# EAGLE schematic AOA-control-revC (EAGLE 7.0.0)
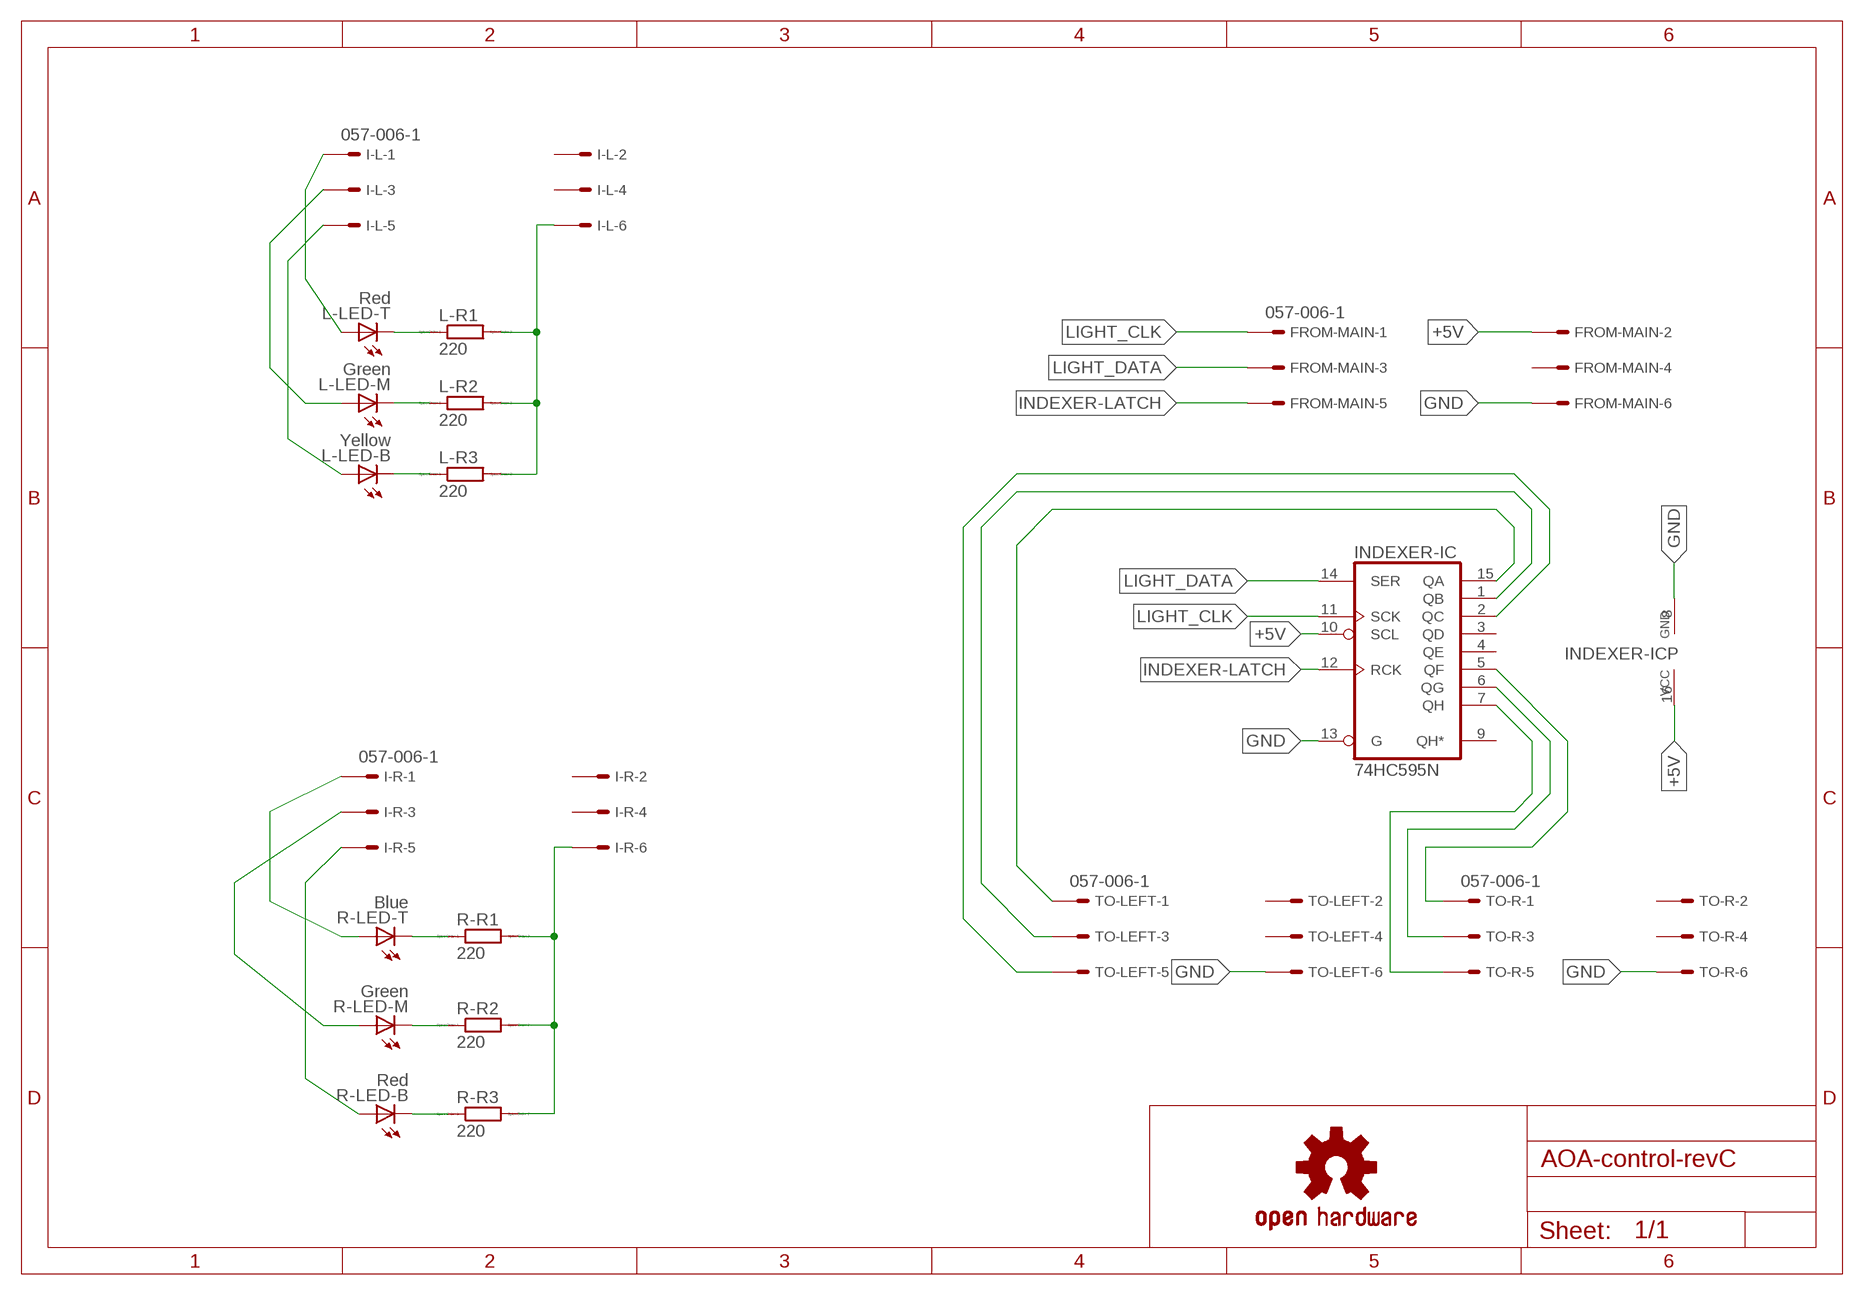
[diagram p0: schematic, sheet 1]

## Parts
FROM-MAIN  057-006-1  [057-006-1]
I-L  057-006-1  [057-006-1]
I-R  057-006-1  [057-006-1]
INDEXER-IC  74HC595N  [DIL16]
L-LED-B  Yellow  LED-2AC-CP41B-WGS  [CP41B]
L-LED-M  Green  LED-2AC-CP41B-WGS  [CP41B]
L-LED-T  Red  LED-2AC-CP41B-WGS  [CP41B]
L-R1  220  R0204/7  [0204/7]
L-R2  220  R0204/7  [0204/7]
L-R3  220  R0204/7  [0204/7]
LOGO1  OSHW-LOGOS  [OSHW-LOGO-S]
R-LED-B  Red  LED-2AC-CP41B-WGS  [CP41B]
R-LED-M  Green  LED-2AC-CP41B-WGS  [CP41B]
R-LED-T  Blue  LED-2AC-CP41B-WGS  [CP41B]
R-R1  220  R0204/7  [0204/7]
R-R2  220  R0204/7  [0204/7]
R-R3  220  R0204/7  [0204/7]
TO-LEFT  057-006-1  [057-006-1]
TO-R  057-006-1  [057-006-1]

## Nets
+5V [Power]: FROM-MAIN.2 INDEXER-IC.10(SCL) INDEXER-IC.16(VCC)
GND [Power]: FROM-MAIN.6 I-L.6 I-R.6 INDEXER-IC.8(GND) INDEXER-IC.13(G) L-R1.2 L-R2.2 L-R3.2 R-R1.2 R-R2.2 R-R3.2 TO-LEFT.6 TO-R.6
INDEXER-LATCH [Signal]: FROM-MAIN.5 INDEXER-IC.12(RCK)
L-B: INDEXER-IC.2(QC) TO-LEFT.5
L-M: INDEXER-IC.1(QB) TO-LEFT.3
L-T: INDEXER-IC.15(QA) TO-LEFT.1
LIGHT_CLK [Signal]: FROM-MAIN.1 INDEXER-IC.11(SCK)
LIGHT_DATA [Signal]: FROM-MAIN.3 INDEXER-IC.14(SER)
N$1 [Signal]: I-L.1 L-LED-T.2(A) L-LED-T.3(A)
N$2 [Signal]: I-L.3 L-LED-M.2(A) L-LED-M.3(A)
N$3 [Signal]: I-L.5 L-LED-B.2(A) L-LED-B.3(A)
N$4 [Signal]: R-LED-B.1(C) R-LED-B.4(C) R-R3.1
N$5 [Signal]: I-R.1 R-LED-T.2(A) R-LED-T.3(A)
N$6 [Signal]: I-R.3 R-LED-M.2(A) R-LED-M.3(A)
N$7 [Signal]: I-R.5 R-LED-B.2(A) R-LED-B.3(A)
N$8 [Signal]: L-LED-B.1(C) L-LED-B.4(C) L-R3.1
N$9 [Signal]: L-LED-M.1(C) L-LED-M.4(C) L-R2.1
N$10 [Signal]: L-LED-T.1(C) L-LED-T.4(C) L-R1.1
N$12 [Signal]: R-LED-M.1(C) R-LED-M.4(C) R-R2.1
N$13 [Signal]: R-LED-T.1(C) R-LED-T.4(C) R-R1.1
R-B: INDEXER-IC.7(QH) TO-R.5
R-M: INDEXER-IC.6(QG) TO-R.3
R-T: INDEXER-IC.5(QF) TO-R.1
Unconnected: FROM-MAIN.4 I-L.2 I-L.4 I-R.2 I-R.4 INDEXER-IC.3(QD) INDEXER-IC.4(QE) INDEXER-IC.9(QH*) TO-LEFT.2 TO-LEFT.4 TO-R.2 TO-R.4

## Library data of the parts
FROM-MAIN I-L I-R TO-LEFT TO-R = con-panduit:057-006-: CONNECTOR 6-pin series 057 contact pc board low profile headers; OC_FARNELL: unknown; OC_NEWARK: unknown
INDEXER-IC = 74xx-eu:74*595: 8-bit SHIFT REGISTER, output latch
L-LED-B L-LED-M L-LED-T R-LED-B R-LED-M R-LED-T = led:LED-2AC-: LEDs with 2 Cathode & 2 Anode - Kingbright SUPER FLUX LED LAMP Source: www.us.kingbright.com/images/catalog/SPEC/W7676CPBC-H.pdf Cree® P4 LED CP41B-WES/WGS Source: Data sheet <http://www.cree.com/products/pdf/LEDlamps/CP41B-WES&WGS.pdf>
L-R1-L-R3 R-R1-R-R3 = eagle-ltspice:R: RESISTOR, European symbol; SPICEMODEL: NONE; SPICEPREFIX: R
LOGO1 = SparkFun-Aesthetics:OSHW-LOGO: Open Source Hardware Logo This logo indicates the piece of hardware it is found on incorporates a OSHW license and/or adheres to the definition of open source hardware found here: http://freedomdefined.org/OSHW

## Net classes
1 Signal: width 0.254 mm, drill 0.254 mm, clearance 0.254 mm
2 Power: width 0.381 mm, drill 0.381 mm, clearance 0.381 mm